# EAGLE design Nucleo_DCO_PSU (EAGLE 9.0.1)
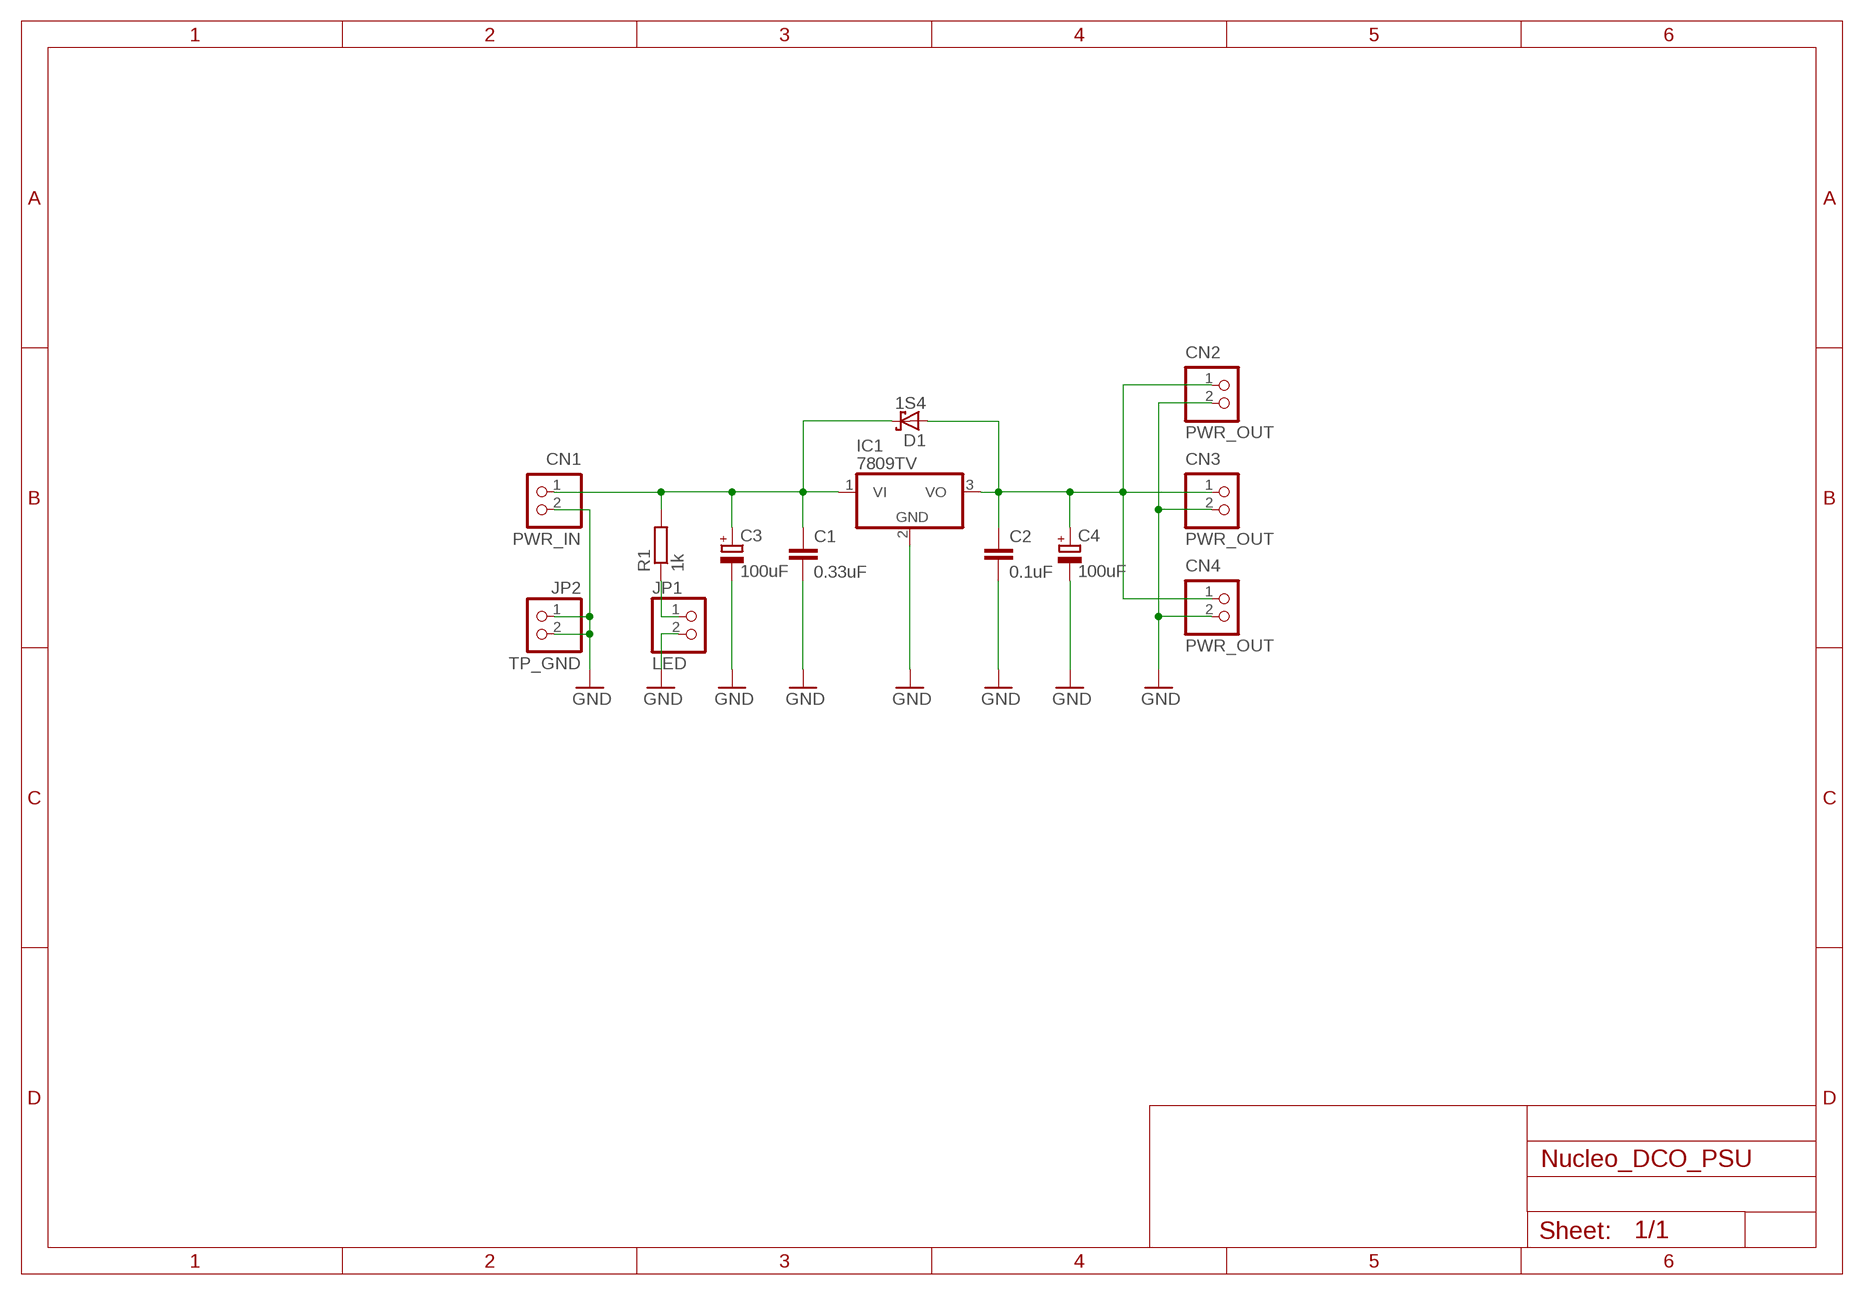
[diagram p0: schematic, sheet 1]

## Parts
C1  0.33uF  C-EU025-024X044  [C025-024X044]
C2  0.1uF  C-EU025-024X044  [C025-024X044]
C3  100uF  CPOL-EUE5-8.5  [E5-8,5]
C4  100uF  CPOL-EUE5-8.5  [E5-8,5]
CN1  PWR_IN  B2B-XH-A  [B2B-XH-A]
CN2  PWR_OUT  B2B-XH-A  [B2B-XH-A]
CN3  PWR_OUT  B2B-XH-A  [B2B-XH-A]
CN4  PWR_OUT  B2B-XH-A  [B2B-XH-A]
D1  1S4  SCHOTTKY-DIODEDO35-7  [DO35-7]
IC1  7809TV  7812TV  [TO220V]
JP1  LED  PINHD-1X2  [1X02]
JP2  TP_GND  PINHD-1X2  [1X02]
R1  1k  R-EU_0207/7  [0207/7]

## Nets
GND: C1.2 C2.2 C3.- C4.- CN1.2 CN2.2 CN3.2 CN4.2 IC1.2(GND) JP1.2 JP2.1 JP2.2
N$1: JP1.1 R1.1
N$3: C1.1 C3.+ CN1.1 D1.C IC1.1(VI) R1.2
N$4: C2.1 C4.+ CN2.1 CN3.1 CN4.1 D1.A IC1.3(VO)

## Library data of the parts
C1 C2 = rcl:C-EU: CAPACITOR, European symbol; SPICEPREFIX: C
C3 C4 = rcl:CPOL-EU: POLARIZED CAPACITOR, European symbol; SPICEPREFIX: C
CN1-CN4 = jst-xh:B2B-XH-A: Wire-to-Board 2.5mm pitch top mount connector Source: http://www.jst-mfg.com/product/pdf/jpn/XH.pdf http://www.jst-mfg.com/product/detail.php?series=277
D1 = diode:SCHOTTKY-DIODE: Schottky Diode
IC1 = linear:78*: Positive VOLTAGE REGULATOR Source: http://cache.national.com/ds/LM/LM78L05.pdf http://www.fairchildsemi.com/ds/LM/LM7805.pdf
JP1 JP2 = pinhead:PINHD-1X2: PIN HEADER
R1 = rcl:R-EU_: RESISTOR, European symbol; SPICEPREFIX: R

## Board
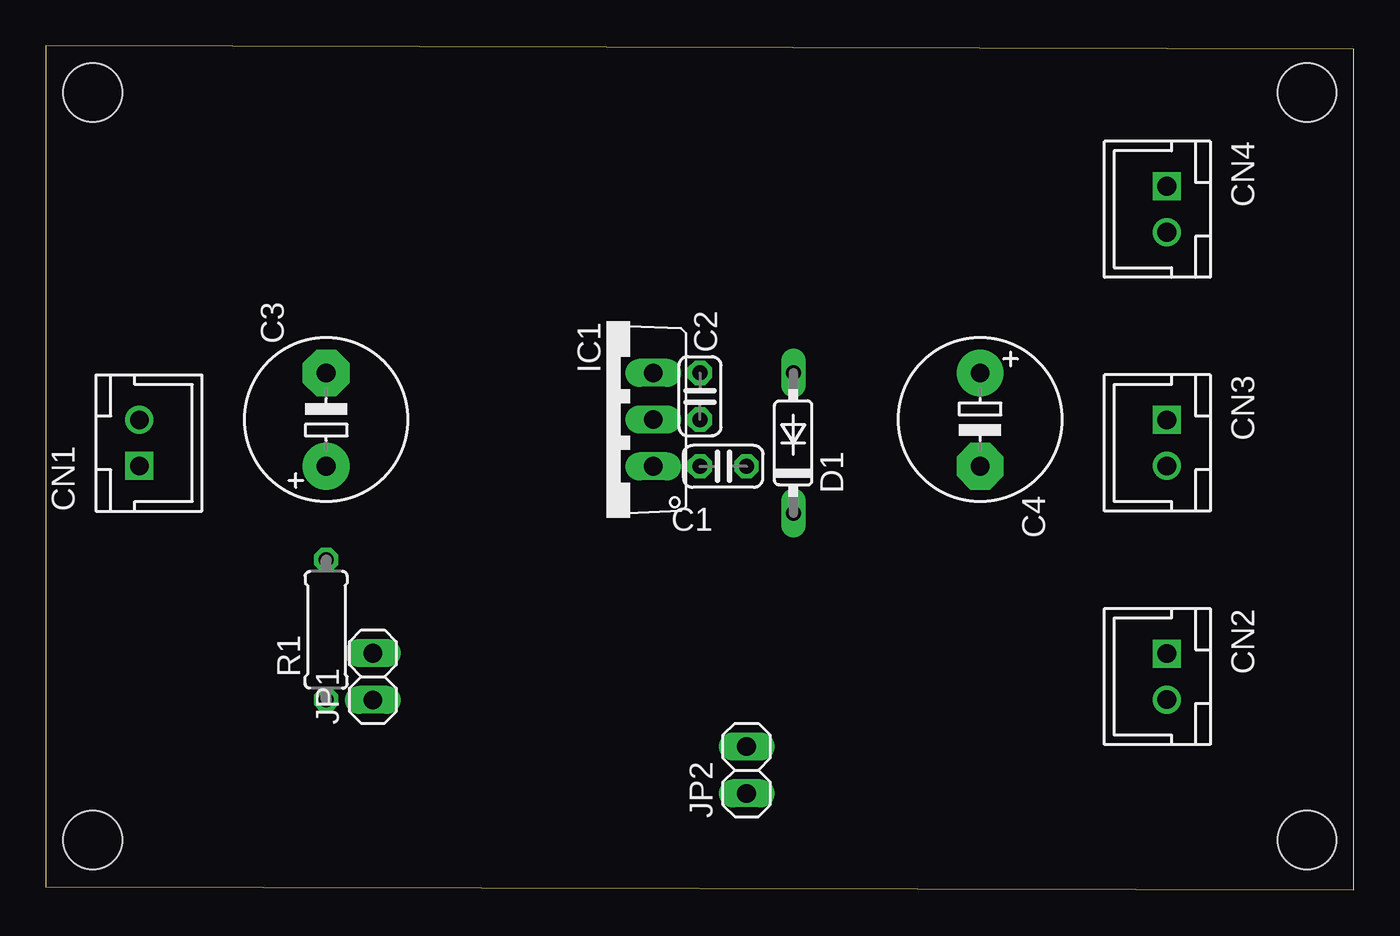
[diagram p1: board, top side]
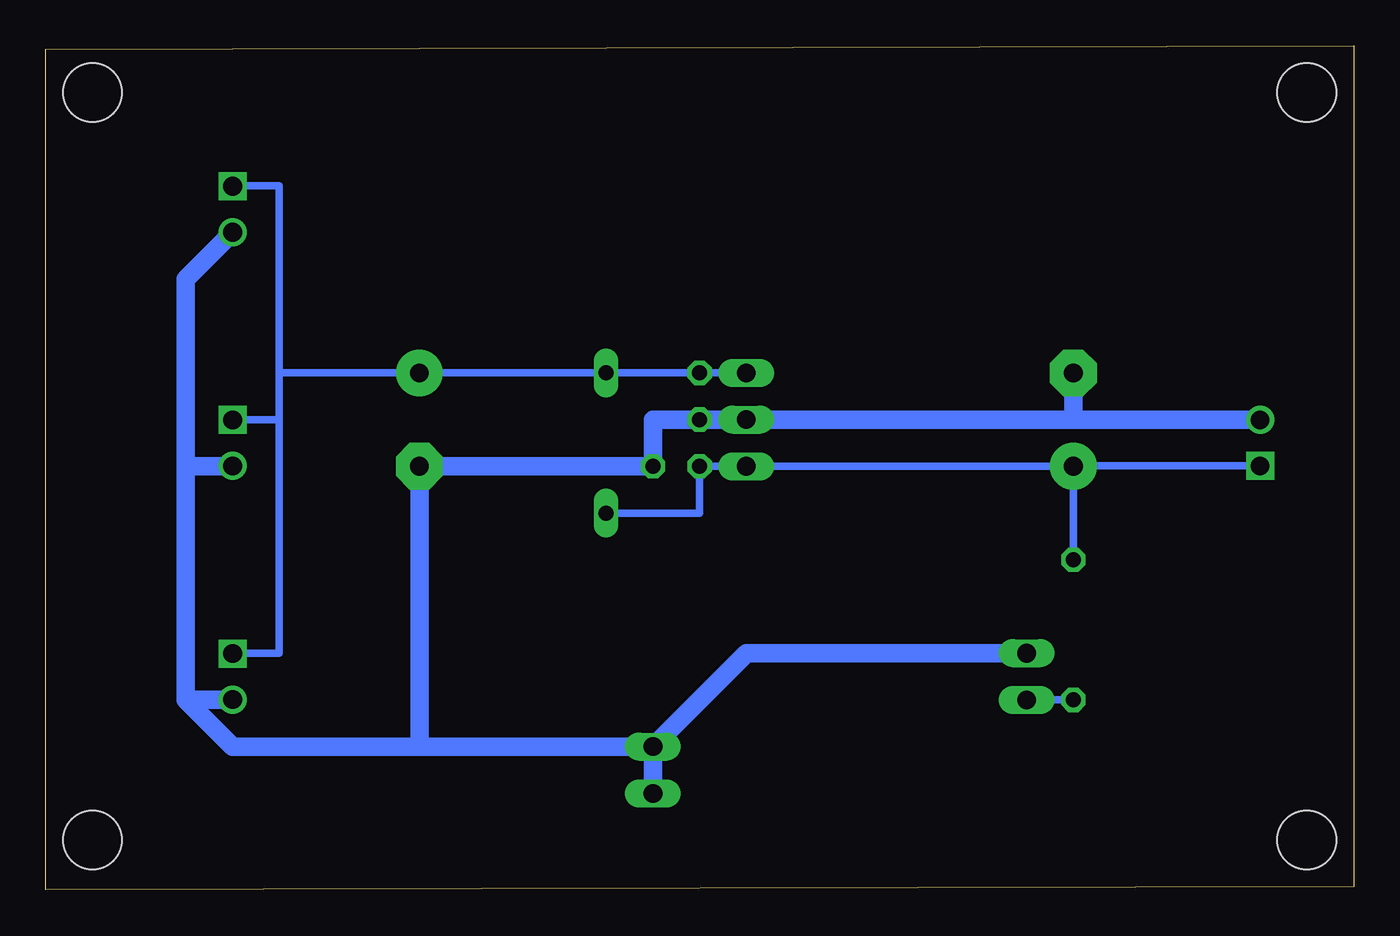
[diagram p2: board, bottom side, seen from below]

Size 71.11 x 45.88 mm. Coordinates in mm from the lower left corner, seen from the top.
Outline: 0,0.17 71.11,0 71.11,45.71 0,45.88 0,0.17
Copper layers (1*16): Top 0.035mm / dielectric 1.5mm / Bottom 0.035mm
Design rules "default": minimum track width 6mil, minimum drill 0.35mm, track to track 6mil, track to pad 6mil, pad to pad 6mil, via to via 6mil, smd to smd 6mil, copper to edge 40mil, drill to drill 6mil, minimum pad ring 10mil, minimum via ring 8mil, stop-mask expansion 4mil, vias tented up to drill 0mil, thermal gap 10mil
Holes 3.2 mm at 2.54,43.35 2.54,2.71 68.58,2.71 68.58,43.35

### Footprints (pad centres in the part's own frame; a part is rotated, then mirrored left to right if it is on the bottom)
C025-024X044 = drill 0.813 octagon: 1 -1.27,0; 2 1.27,0
E5-8,5 = drill 1.016 pad 2.54: + -2.54,0 | drill 1.016 pad 2.54 octagon: - 2.54,0
B2B-XH-A = drill 1.016 square: 1 -1.25,0 | drill 1.016: 2 1.25,0
DO35-7 = drill 0.813 long: A 3.81,0; C -3.81,0
TO220V = drill 1.016 long: 1 -2.54,-2.54; 2 0,-2.54; 3 2.54,-2.54
1X02 = drill 1.016 long: 1 -1.27,0; 2 1.27,0
0207/7 = drill 0.813 octagon: 1 -3.81,0; 2 3.81,0

### Placement (x,y rotation side)
C1  36.83,23.03 0 top
C2  35.56,26.84 270 top
C3  15.24,25.57 90 top
C4  50.8,25.57 270 top
CN1  5.08,24.3 90 top
CN2  60.96,11.6 270 top
CN3  60.96,24.3 270 top
CN4  60.96,37 270 top
D1  40.64,24.3 90 top
IC1  30.48,25.57 90 top
JP1  17.78,11.6 90 top
JP2  38.1,6.52 90 top
R1  15.24,14.14 90 top

### Tracks (layer width: path | path; a pad name or v marks a point on that pad's centre or on a via)
GND
  Bottom 1.016: CN1.2 5.1,25.57 15.24,25.57 | 15.24,25.57 IC1.2 C2.2 38.1,25.57 C1.2 C4.- 50.8,7.79 | C3.- 15.24,25.57 | CN4.2 63.5,33.21 63.5,23.03 | 63.5,23.03 63.5,10.33 | CN2.2 60.98,10.33 63.5,10.33 | CN3.2 60.98,23.03 63.5,23.03 | JP2.2 50.8,7.79 | JP2.1 JP2.2 | JP1.2 33.02,12.87 JP2.2 | 50.8,7.79 60.96,7.79 63.5,10.33
N$1
  Bottom 0.406: R1.1 JP1.1
N$3
  Bottom 0.406: CN1.1 15.22,23.05 C3.+ | C3.+ R1.2 | C3.+ IC1.1 C1.1 35.56,20.49 D1.C
N$4
  Bottom 0.406: IC1.3 C2.1 D1.A C4.+ 58.42,28.11 | CN4.1 60.94,38.27 58.42,38.27 58.42,28.11 | 58.42,28.11 58.42,25.57 | 58.42,25.57 58.42,12.87 60.96,12.87 CN2.1 | CN3.1 58.44,25.55 58.42,25.57

### Text on the board
Document: Nucleo DCO PSU | http://dad8893.blogspot.com/